# EAGLE schematic OpenDeck (EAGLE 6.5.0)
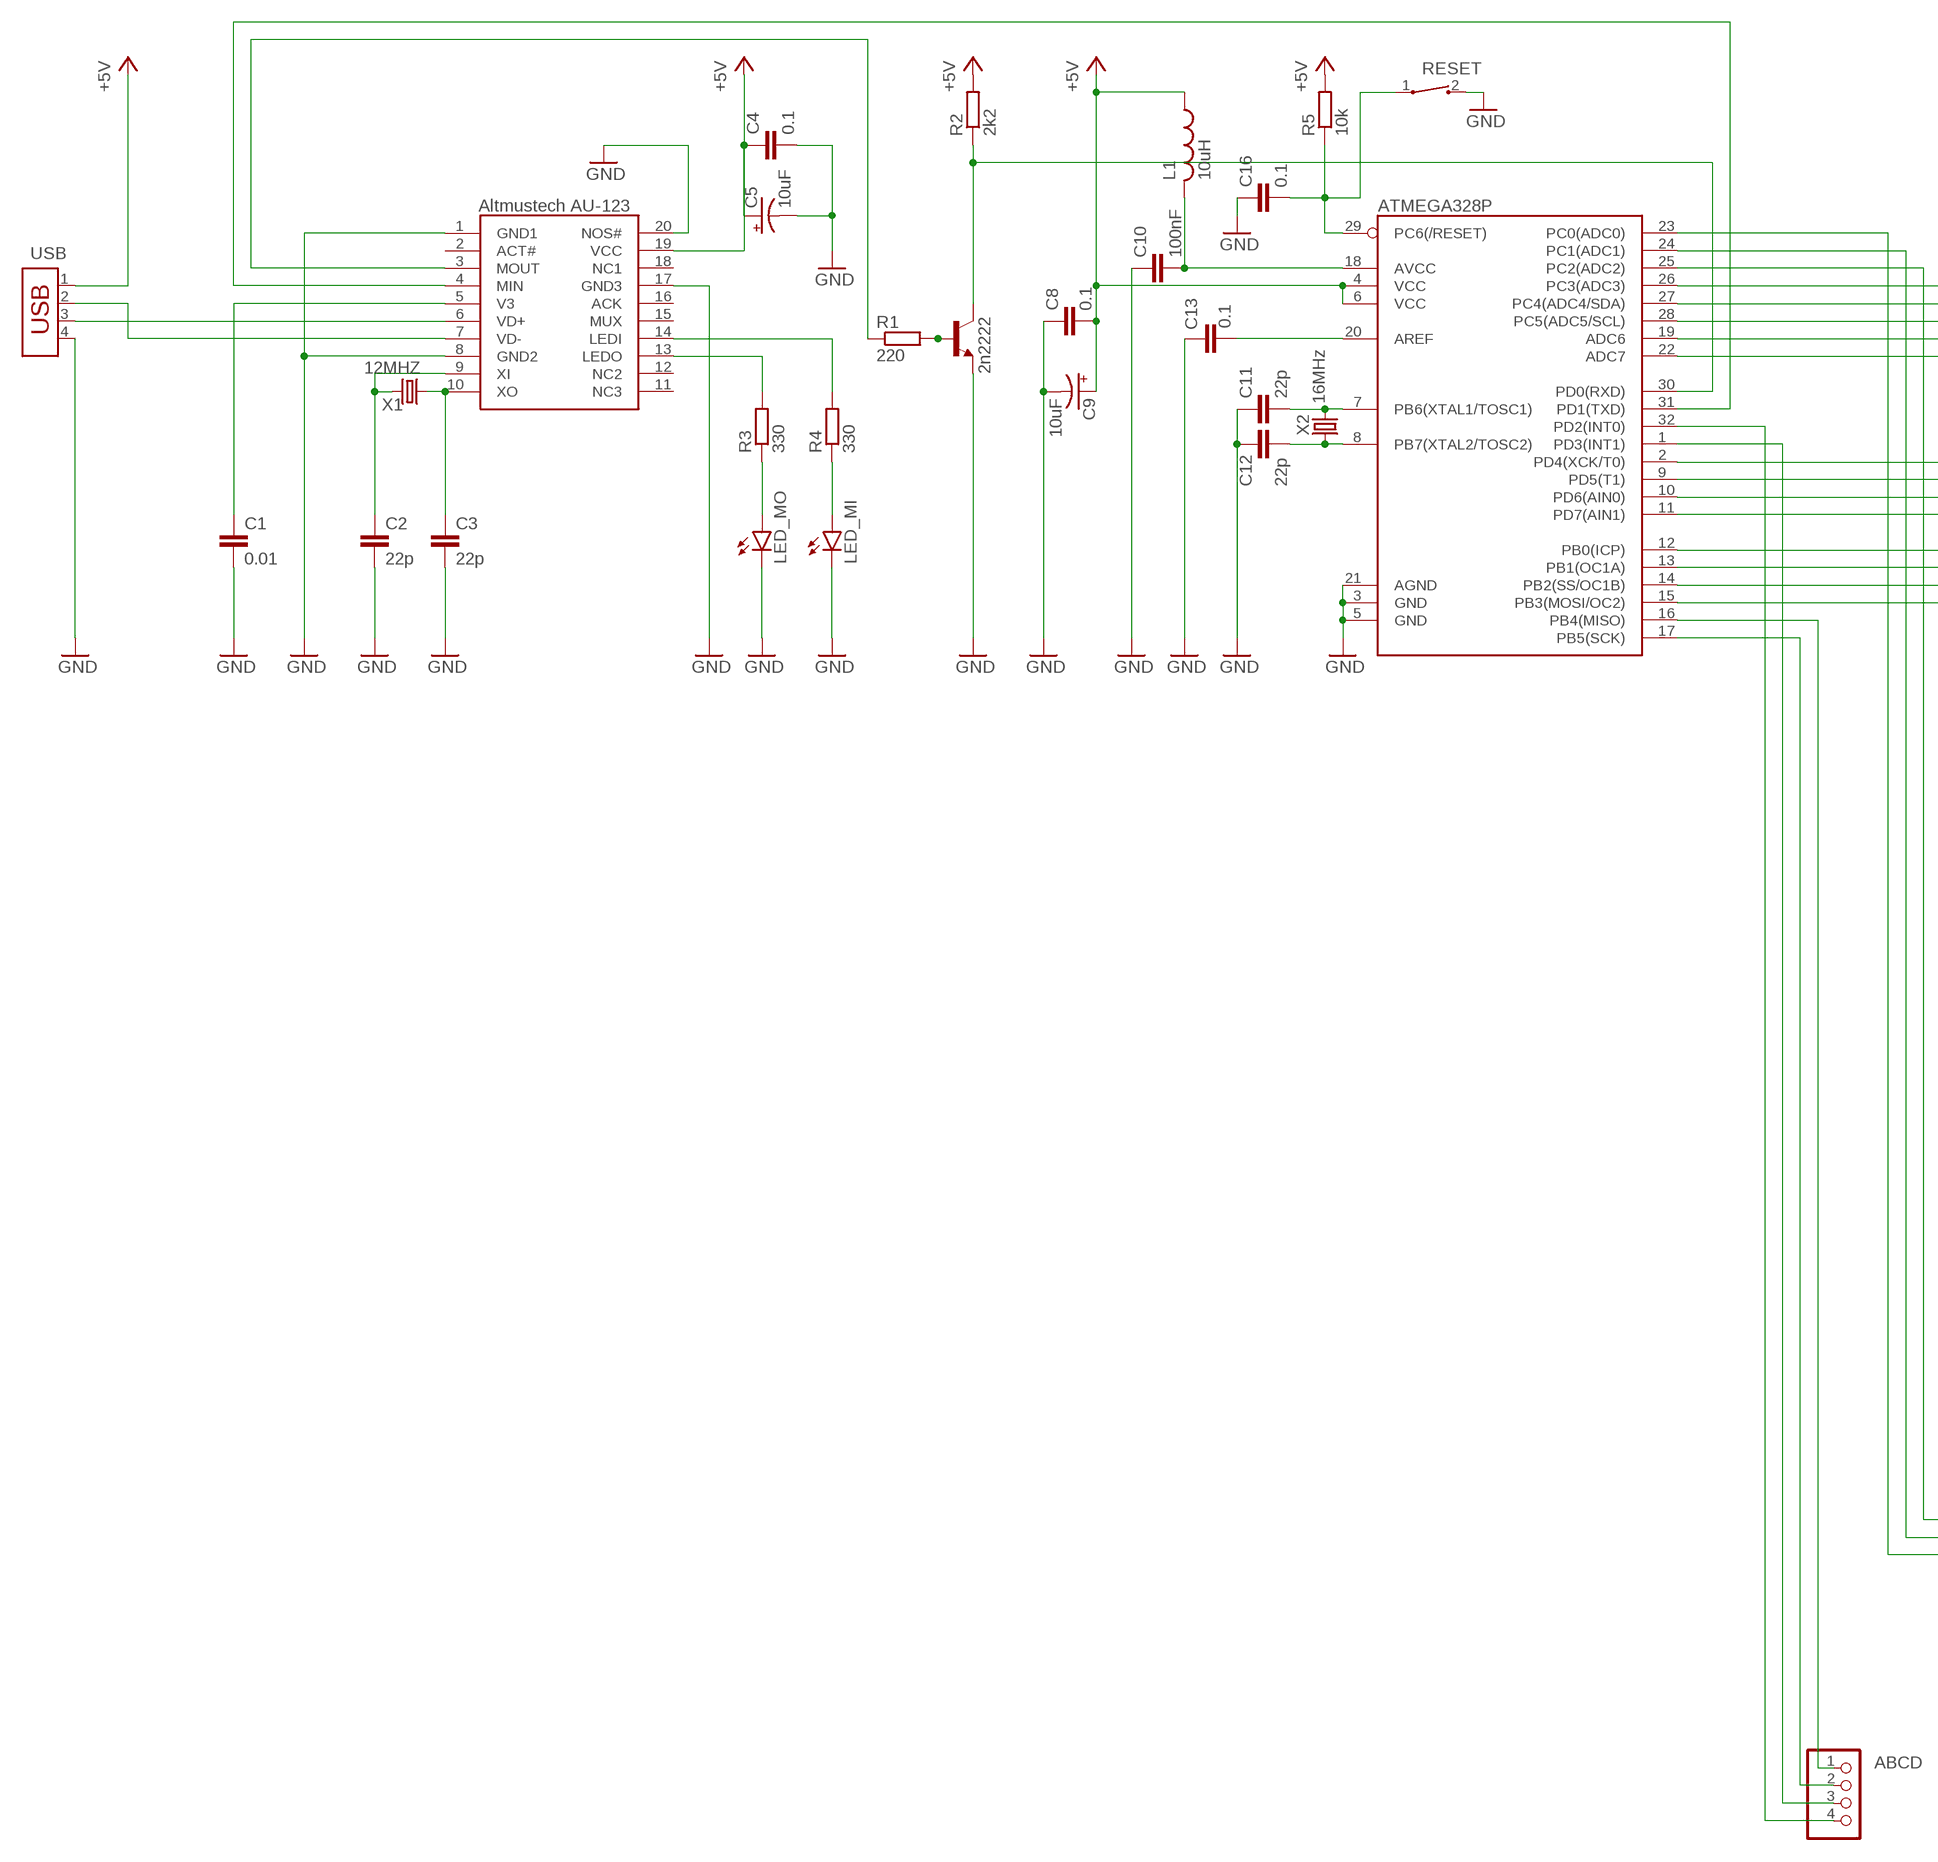
[diagram p0: schematic, sheet 1, part 1 of 2]
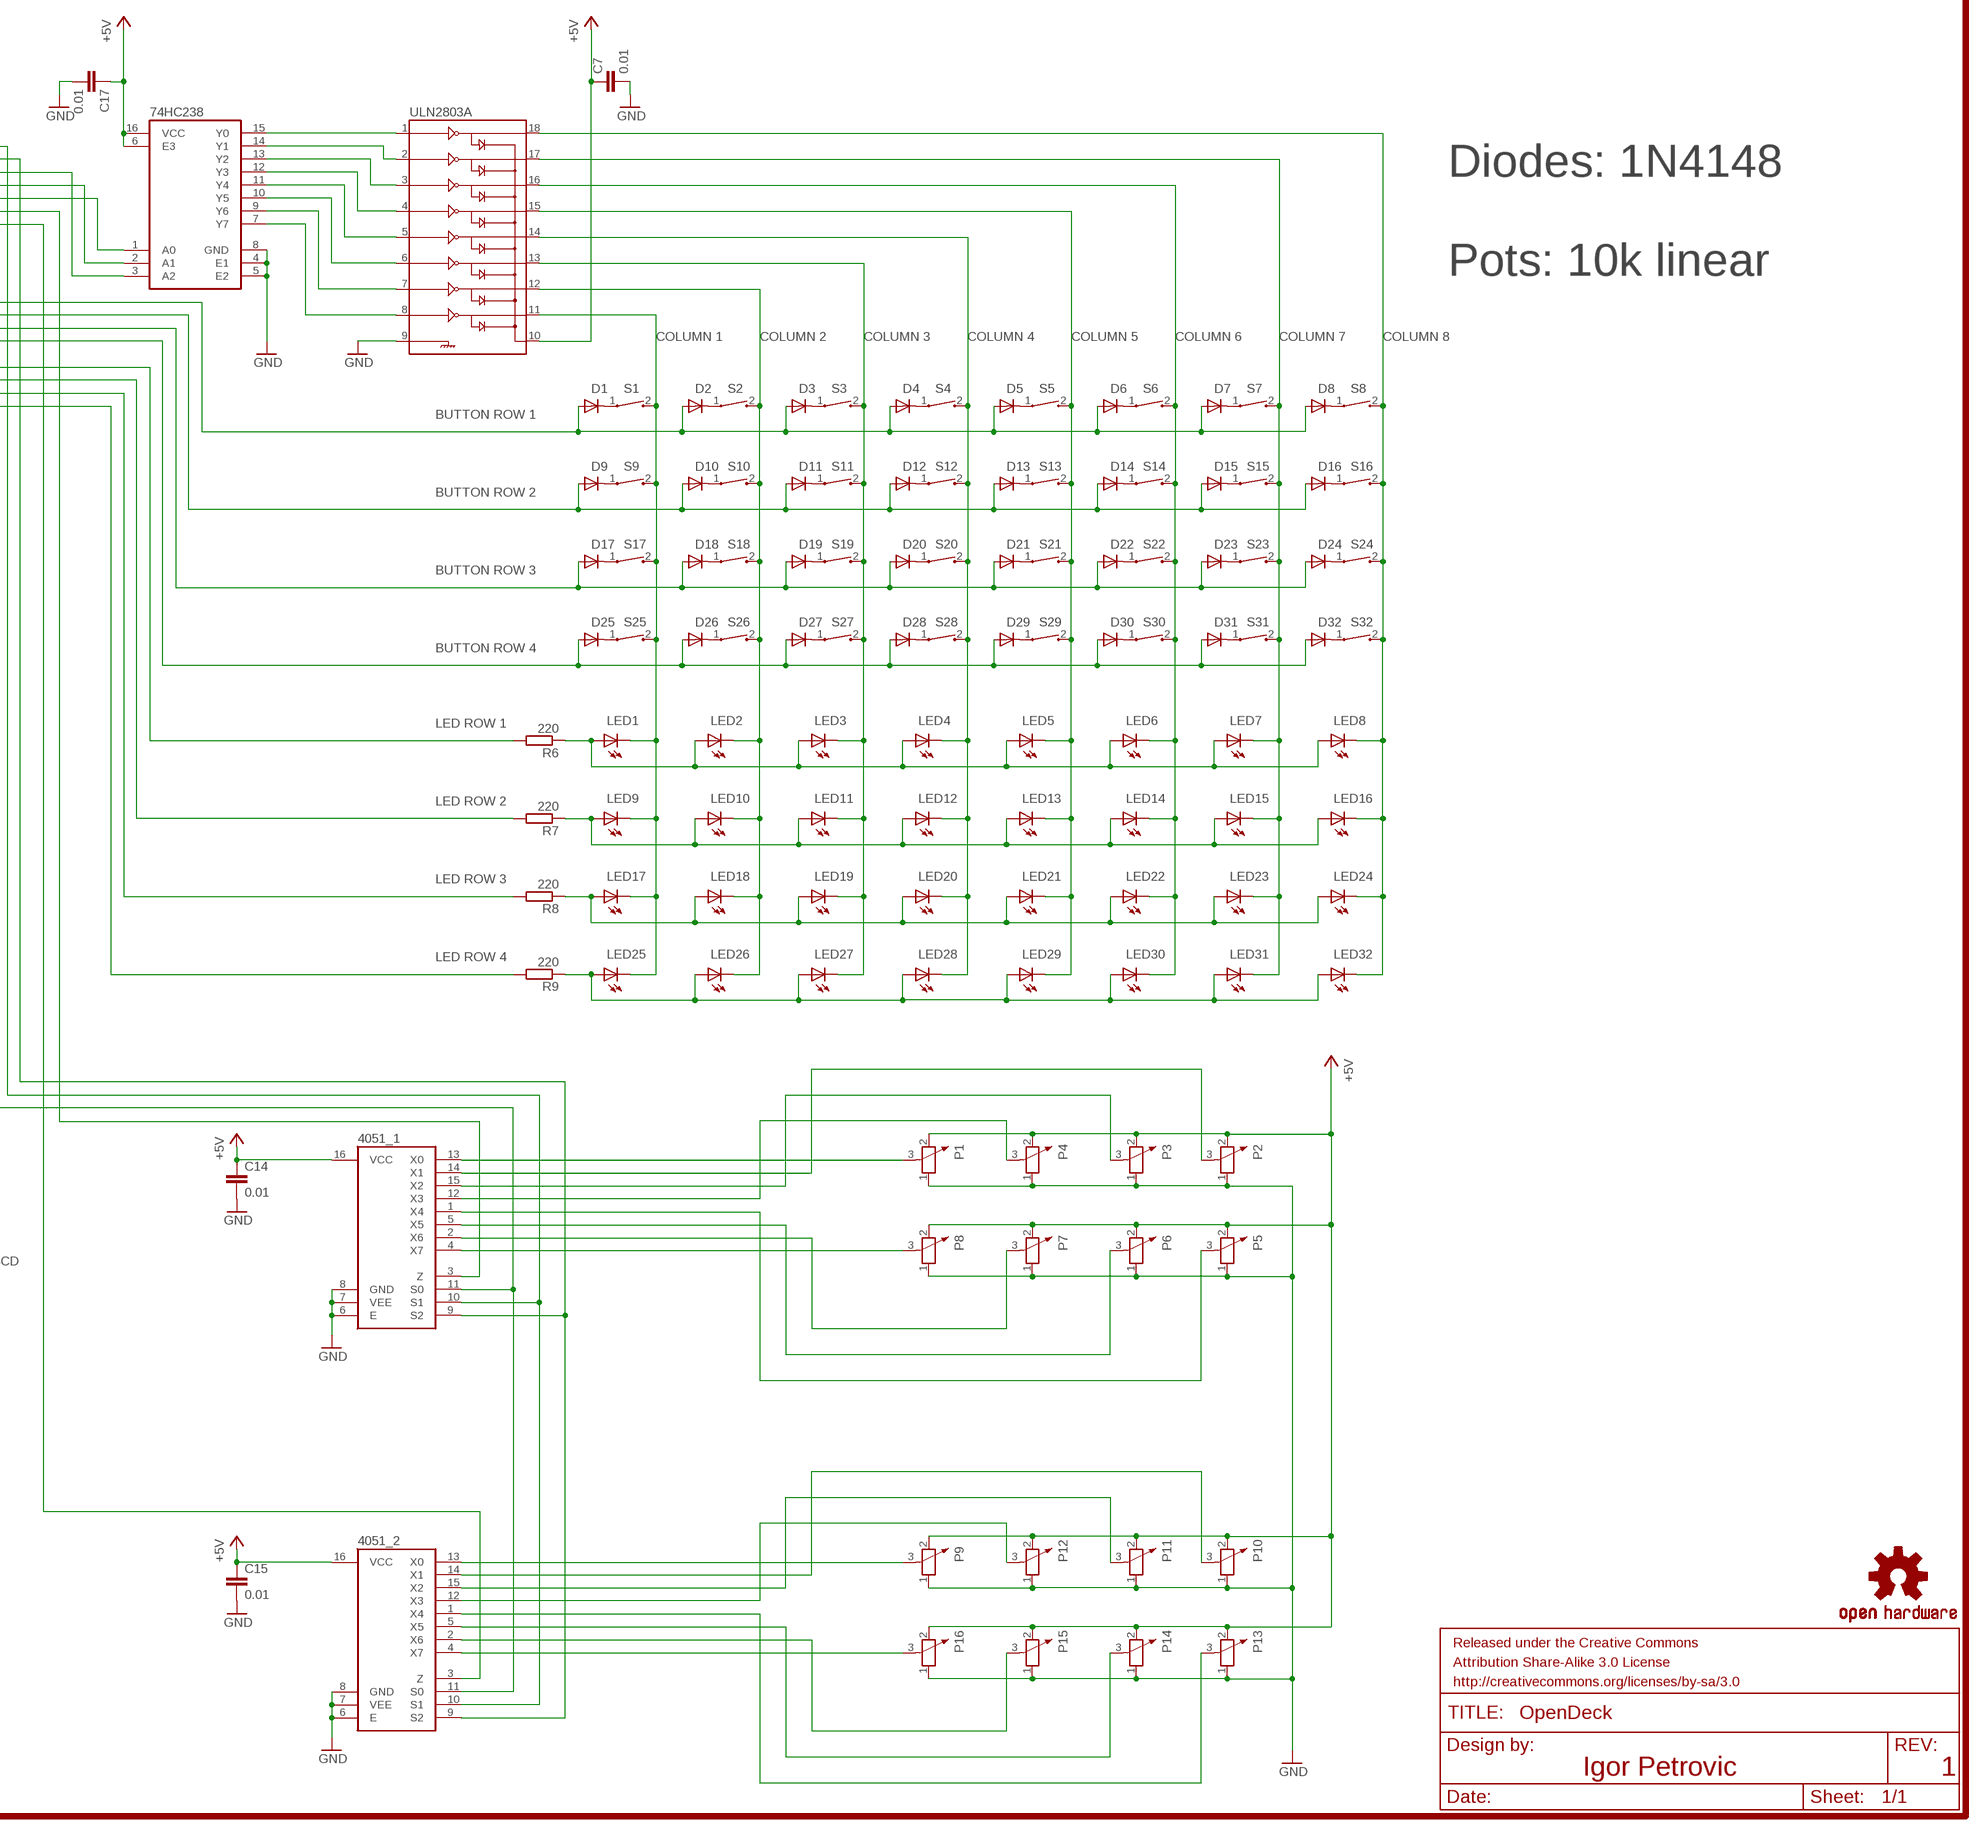
[diagram p1: schematic, sheet 1, part 2 of 2]

## Parts
74HC238  74HC238-FULL  [DIL16]
4051_1  4051-FULL  [DIL16]
4051_2  4051-FULL  [DIL16]
ABCD  PINHD-1X4  [1X04]
ALTMUSTECH_AU123  XC18V01_SO20  [SOP20]
C1  0.01  C-EU025-025X050  [C025-025X050]
C2  22p  C-EU025-025X050  [C025-025X050]
C3  22p  C-EU025-025X050  [C025-025X050]
C4  0.1  C-EU025-025X050  [C025-025X050]
C5  10uF  100UF-63V-20%(ELECT)  [PANASONIC_H13]
C7  0.01  C-EU025-025X050  [C025-025X050]
C8  0.1  C-EU025-025X050  [C025-025X050]
C9  10uF  100UF-63V-20%(ELECT)  [PANASONIC_H13]
C10  100nF  C-EU025-025X050  [C025-025X050]
C11  22p  C-EU025-025X050  [C025-025X050]
C12  22p  C-EU025-025X050  [C025-025X050]
C13  0.1  C-EU025-025X050  [C025-025X050]
C14  0.01  C-EU025-025X050  [C025-025X050]
C15  0.01  C-EU025-025X050  [C025-025X050]
C16  0.1  C-EU025-025X050  [C025-025X050]
C17  0.01  C-EU025-025X050  [C025-025X050]
D1  1N4148DO35-10  [DO35-10]
D2  1N4148DO35-10  [DO35-10]
D3  1N4148DO35-10  [DO35-10]
D4  1N4148DO35-10  [DO35-10]
D5  1N4148DO35-10  [DO35-10]
D6  1N4148DO35-10  [DO35-10]
D7  1N4148DO35-10  [DO35-10]
D8  1N4148DO35-10  [DO35-10]
D9  1N4148DO35-10  [DO35-10]
D10  1N4148DO35-10  [DO35-10]
D11  1N4148DO35-10  [DO35-10]
D12  1N4148DO35-10  [DO35-10]
D13  1N4148DO35-10  [DO35-10]
D14  1N4148DO35-10  [DO35-10]
D15  1N4148DO35-10  [DO35-10]
D16  1N4148DO35-10  [DO35-10]
D17  1N4148DO35-10  [DO35-10]
D18  1N4148DO35-10  [DO35-10]
D19  1N4148DO35-10  [DO35-10]
D20  1N4148DO35-10  [DO35-10]
D21  1N4148DO35-10  [DO35-10]
D22  1N4148DO35-10  [DO35-10]
D23  1N4148DO35-10  [DO35-10]
D24  1N4148DO35-10  [DO35-10]
D25  1N4148DO35-10  [DO35-10]
D26  1N4148DO35-10  [DO35-10]
D27  1N4148DO35-10  [DO35-10]
D28  1N4148DO35-10  [DO35-10]
D29  1N4148DO35-10  [DO35-10]
D30  1N4148DO35-10  [DO35-10]
D31  1N4148DO35-10  [DO35-10]
D32  1N4148DO35-10  [DO35-10]
FRAME1  FRAME-LETTER  [CREATIVE_COMMONS]
L1  10uH  L-US0204/7  [0204/7]
LED1  LAW51M  [W51]
LED2  LAW51M  [W51]
LED3  LAW51M  [W51]
LED4  LAW51M  [W51]
LED5  LAW51M  [W51]
LED6  LAW51M  [W51]
LED7  LAW51M  [W51]
LED8  LAW51M  [W51]
LED9  LAW51M  [W51]
LED10  LAW51M  [W51]
LED11  LAW51M  [W51]
LED12  LAW51M  [W51]
LED13  LAW51M  [W51]
LED14  LAW51M  [W51]
LED15  LAW51M  [W51]
LED16  LAW51M  [W51]
LED17  LAW51M  [W51]
LED18  LAW51M  [W51]
LED19  LAW51M  [W51]
LED20  LAW51M  [W51]
LED21  LAW51M  [W51]
LED22  LAW51M  [W51]
LED23  LAW51M  [W51]
LED24  LAW51M  [W51]
LED25  LAW51M  [W51]
LED26  LAW51M  [W51]
LED27  LAW51M  [W51]
LED28  LAW51M  [W51]
LED29  LAW51M  [W51]
LED30  LAW51M  [W51]
LED31  LAW51M  [W51]
LED32  LAW51M  [W51]
LED_MI  LED3MM  [LED3MM]
LED_MO  LED3MM  [LED3MM]
P1  10k  POTENTIOMETER_PT-10  [PT-10]
P2  10k  POTENTIOMETER_PT-10  [PT-10]
P3  10k  POTENTIOMETER_PT-10  [PT-10]
P4  10k  POTENTIOMETER_PT-10  [PT-10]
P5  10k  POTENTIOMETER_PT-10  [PT-10]
P6  10k  POTENTIOMETER_PT-10  [PT-10]
P7  10k  POTENTIOMETER_PT-10  [PT-10]
P8  10k  POTENTIOMETER_PT-10  [PT-10]
P9  10k  POTENTIOMETER_PT-10  [PT-10]
P10  10k  POTENTIOMETER_PT-10  [PT-10]
P11  10k  POTENTIOMETER_PT-10  [PT-10]
P12  10k  POTENTIOMETER_PT-10  [PT-10]
P13  10k  POTENTIOMETER_PT-10  [PT-10]
P14  10k  POTENTIOMETER_PT-10  [PT-10]
P15  10k  POTENTIOMETER_PT-10  [PT-10]
P16  10k  POTENTIOMETER_PT-10  [PT-10]
Q1  2n2222  TRANSISTOR_NPN2N3904  [TO-92]
R1  220  R-EU_0204/7  [0204/7]
R2  2k2  R-EU_0204/7  [0204/7]
R3  330  R-EU_0204/7  [0204/7]
R4  330  R-EU_0204/7  [0204/7]
R5  10k  R-EU_0204/7  [0204/7]
R6  220  R-EU_0204/7  [0204/7]
R7  220  R-EU_0204/7  [0204/7]
R8  220  R-EU_0204/7  [0204/7]
R9  220  R-EU_0204/7  [0204/7]
RESET  CT10-XXXX-A2  [CT10-XXXX-A2]
S1  CT10-XXXX-A2  [CT10-XXXX-A2]
S2  CT10-XXXX-A2  [CT10-XXXX-A2]
S3  CT10-XXXX-A2  [CT10-XXXX-A2]
S4  CT10-XXXX-A2  [CT10-XXXX-A2]
S5  CT10-XXXX-A2  [CT10-XXXX-A2]
S6  CT10-XXXX-A2  [CT10-XXXX-A2]
S7  CT10-XXXX-A2  [CT10-XXXX-A2]
S8  CT10-XXXX-A2  [CT10-XXXX-A2]
S9  CT10-XXXX-A2  [CT10-XXXX-A2]
S10  CT10-XXXX-A2  [CT10-XXXX-A2]
S11  CT10-XXXX-A2  [CT10-XXXX-A2]
S12  CT10-XXXX-A2  [CT10-XXXX-A2]
S13  CT10-XXXX-A2  [CT10-XXXX-A2]
S14  CT10-XXXX-A2  [CT10-XXXX-A2]
S15  CT10-XXXX-A2  [CT10-XXXX-A2]
S16  CT10-XXXX-A2  [CT10-XXXX-A2]
S17  CT10-XXXX-A2  [CT10-XXXX-A2]
S18  CT10-XXXX-A2  [CT10-XXXX-A2]
S19  CT10-XXXX-A2  [CT10-XXXX-A2]
S20  CT10-XXXX-A2  [CT10-XXXX-A2]
S21  CT10-XXXX-A2  [CT10-XXXX-A2]
S22  CT10-XXXX-A2  [CT10-XXXX-A2]
S23  CT10-XXXX-A2  [CT10-XXXX-A2]
S24  CT10-XXXX-A2  [CT10-XXXX-A2]
S25  CT10-XXXX-A2  [CT10-XXXX-A2]
S26  CT10-XXXX-A2  [CT10-XXXX-A2]
S27  CT10-XXXX-A2  [CT10-XXXX-A2]
S28  CT10-XXXX-A2  [CT10-XXXX-A2]
S29  CT10-XXXX-A2  [CT10-XXXX-A2]
S30  CT10-XXXX-A2  [CT10-XXXX-A2]
S31  CT10-XXXX-A2  [CT10-XXXX-A2]
S32  CT10-XXXX-A2  [CT10-XXXX-A2]
U2  ATMEGA328P  ATMEGA328_SMT  [TQFP32-08]
U$3  OSHW-LOGOS  [OSHW-LOGO-S]
ULN2803A  ULN2803DIP  [DIL18]
USB  USB-787616  [USB]
X1  12MHZ  CRYSTALHC49US  [HC49US]
X2  16MHz  CRYSTALHC49US  [HC49US]

## Nets
A: ABCD.1 U2.16(PB4(MISO))
A0: 74HC238.3(A2) U2.26(PC3(ADC3))
A1: 74HC238.2(A1) U2.27(PC4(ADC4/SDA))
A2: 74HC238.1(A0) U2.28(PC5(ADC5/SCL))
B: ABCD.2 U2.17(PB5(SCK))
B_ROW_1: D1.A D2.A D3.A D4.A D5.A D6.A D7.A D8.A U2.2(PD4(XCK/T0))
B_ROW_2: D9.A D10.A D11.A D12.A D13.A D14.A D15.A D16.A U2.9(PD5(T1))
B_ROW_3: D17.A D18.A D19.A D20.A D21.A D22.A D23.A D24.A U2.10(PD6(AIN0))
B_ROW_4: D25.A D26.A D27.A D28.A D29.A D30.A D31.A D32.A U2.11(PD7(AIN1))
C: ABCD.3 U2.1(PD3(INT1))
COLUMN_1: LED1.C LED9.C LED17.C LED25.C S1.2 S9.2 S17.2 S25.2 ULN2803A.11
COLUMN_2: LED2.C LED10.C LED18.C LED26.C S2.2 S10.2 S18.2 S26.2 ULN2803A.12
COLUMN_3: LED3.C LED11.C LED19.C LED27.C S3.2 S11.2 S19.2 S27.2 ULN2803A.13
COLUMN_4: LED4.C LED12.C LED20.C LED28.C S4.2 S12.2 S20.2 S28.2 ULN2803A.14
COLUMN_5: LED5.C LED13.C LED21.C LED29.C S5.2 S13.2 S21.2 S29.2 ULN2803A.15
COLUMN_6: LED6.C LED14.C LED22.C LED30.C S6.2 S14.2 S22.2 S30.2 ULN2803A.16
COLUMN_7: LED7.C LED15.C LED23.C LED31.C S7.2 S15.2 S23.2 S31.2 ULN2803A.17
COLUMN_8: LED8.C LED16.C LED24.C LED32.C S8.2 S16.2 S24.2 S32.2 ULN2803A.18
D: ABCD.4 U2.32(PD2(INT0))
DECODER_OUT_1: 74HC238.15(Y0) ULN2803A.1
DECODER_OUT_2: 74HC238.14(Y1) ULN2803A.2
DECODER_OUT_3: 74HC238.13(Y2) ULN2803A.3
DECODER_OUT_4: 74HC238.12(Y3) ULN2803A.4
DECODER_OUT_5: 74HC238.11(Y4) ULN2803A.5
DECODER_OUT_6: 74HC238.10(Y5) ULN2803A.6
DECODER_OUT_7: 74HC238.9(Y6) ULN2803A.7
DECODER_OUT_8: 74HC238.7(Y7) ULN2803A.8
GND: 74HC238.4(E1) 74HC238.5(E2) 74HC238.8(GND) 4051_1.6(E) 4051_1.7(VEE) 4051_1.8(GND) 4051_2.6(E) 4051_2.7(VEE) 4051_2.8(GND) ALTMUSTECH_AU123.1(GND1) ALTMUSTECH_AU123.8(GND2) ALTMUSTECH_AU123.17(GND3) ALTMUSTECH_AU123.20(NOS#) C1.2 C2.2 C3.2 C4.2 C5.- C7.2 C8.1 C9.- C10.1 C11.1 C12.2 C13.2 C14.2 C15.2 C16.1 C17.2 LED_MI.K(C) LED_MO.K(C) P1.1 P2.1 P3.1 P4.1 P5.1 P6.1 P7.1 P8.1 P9.1 P10.1 P11.1 P12.1 P13.1 P14.1 P15.1 P16.1 Q1.1(E) RESET.2 U2.3(GND) U2.5(GND) U2.21(AGND) ULN2803A.9 USB.4
L_ROW_1: LED1.A LED2.A LED3.A LED4.A LED5.A LED6.A LED7.A LED8.A R6.1
L_ROW_2: LED9.A LED10.A LED11.A LED12.A LED13.A LED14.A LED15.A LED16.A R7.1
L_ROW_4: LED25.A LED26.A LED27.A LED28.A LED29.A LED30.A LED31.A LED32.A R9.1
LEDI: ALTMUSTECH_AU123.14(LEDI) R4.2
LEDO: ALTMUSTECH_AU123.13(LEDO) R3.2
MIN: ALTMUSTECH_AU123.4(MIN) U2.31(PD1(TXD))
MOUT: ALTMUSTECH_AU123.3(MOUT) R1.1
MUX_1_IN: 4051_1.3(Z) U2.19(ADC6)
MUX_1_INPUT_1: 4051_1.13(X0) P1.3
MUX_1_INPUT_2: 4051_1.14(X1) P2.3
MUX_1_INPUT_3: 4051_1.15(X2) P3.3
MUX_1_INPUT_4: 4051_1.12(X3) P4.3
MUX_1_INPUT_5: 4051_1.1(X4) P5.3
MUX_1_INPUT_6: 4051_1.5(X5) P6.3
MUX_1_INPUT_7: 4051_1.2(X6) P7.3
MUX_1_INPUT_8: 4051_1.4(X7) P8.3
MUX_2_INPUT_1: 4051_2.13(X0) P9.3
MUX_2_INPUT_2: 4051_2.14(X1) P10.3
MUX_2_INPUT_3: 4051_2.15(X2) P11.3
MUX_2_INPUT_4: 4051_2.12(X3) P12.3
MUX_2_INPUT_5: 4051_2.1(X4) P13.3
MUX_2_INPUT_6: 4051_2.5(X5) P14.3
MUX_2_INPUT_7: 4051_2.2(X6) P15.3
MUX_2_INPUT_8: 4051_2.4(X7) P16.3
MUX_IN_2: 4051_2.3(Z) U2.22(ADC7)
N$2: D15.C S15.1
N$5: R7.2 U2.13(PB1(OC1A))
N$6: R8.2 U2.14(PB2(SS/OC1B))
N$7: R6.2 U2.12(PB0(ICP))
N$8: R9.2 U2.15(PB3(MOSI/OC2))
N$11: D9.C S9.1
N$12: D10.C S10.1
N$13: D11.C S11.1
N$14: D12.C S12.1
N$16: D14.C S14.1
N$18: D16.C S16.1
N$19: Q1.2(B) R1.2
N$22: Q1.3(C) R2.1 U2.30(PD0(RXD))
N$24: D6.C S6.1
N$25: D13.C S13.1
N$27: D5.C S5.1
N$28: LED17.A LED18.A LED19.A LED20.A LED21.A LED22.A LED23.A LED24.A R8.1
N$29: D17.C S17.1
N$30: D18.C S18.1
N$32: D19.C S19.1
N$34: D20.C S20.1
N$35: D21.C S21.1
N$36: D22.C S22.1
N$37: D23.C S23.1
N$38: D1.C S1.1
N$39: D24.C S24.1
N$42: LED_MO.A R3.1
N$43: LED_MI.A R4.1
N$47: C10.2 L1.2 U2.18(AVCC)
N$48: C11.2 U2.7(PB6(XTAL1/TOSC1)) X2.1
N$49: C12.1 U2.8(PB7(XTAL2/TOSC2)) X2.2
N$50: C13.1 U2.20(AREF)
N$52: D25.C S25.1
N$53: D26.C S26.1
N$54: D27.C S27.1
N$55: D28.C S28.1
N$56: D29.C S29.1
N$58: D30.C S30.1
N$59: D31.C S31.1
N$60: D32.C S32.1
N$61: C16.2 R5.1 RESET.1 U2.29(PC6(/RESET))
N$64: D2.C S2.1
N$66: D3.C S3.1
N$67: D4.C S4.1
N$71: D7.C S7.1
N$72: D8.C S8.1
S0: 4051_1.11(S0) 4051_2.11(S0) U2.23(PC0(ADC0))
S1: 4051_1.10(S1) 4051_2.10(S1) U2.24(PC1(ADC1))
S2: 4051_1.9(S2) 4051_2.9(S2) U2.25(PC2(ADC2))
V3: ALTMUSTECH_AU123.5(V3) C1.1
VCC: 74HC238.6(E3) 74HC238.16(VCC) 4051_1.16(VCC) 4051_2.16(VCC) ALTMUSTECH_AU123.19(VCC) C4.1 C5.+ C7.1 C8.2 C9.+ C14.1 C15.1 C17.1 L1.1 P1.2 P2.2 P3.2 P4.2 P5.2 P6.2 P7.2 P8.2 P9.2 P10.2 P11.2 P12.2 P13.2 P14.2 P15.2 P16.2 R2.2 R5.2 U2.4(VCC) U2.6(VCC) ULN2803A.10 USB.1 ; supply symbol labelled +5V
VD+: ALTMUSTECH_AU123.6(VD+) USB.3
VD-: ALTMUSTECH_AU123.7(VD-) USB.2
XI: ALTMUSTECH_AU123.9(XI) C2.1 X1.2
XO: ALTMUSTECH_AU123.10(XO) C3.1 X1.1
Unconnected: ALTMUSTECH_AU123.2(ACT#) ALTMUSTECH_AU123.11(NC3) ALTMUSTECH_AU123.12(NC2) ALTMUSTECH_AU123.15(MUX) ALTMUSTECH_AU123.16(ACK) ALTMUSTECH_AU123.18(NC1) LED1.TH@1(TH) LED1.TH@2(TH) LED1.TH@3(TH) LED2.TH@1(TH) LED2.TH@2(TH) LED2.TH@3(TH) LED3.TH@1(TH) LED3.TH@2(TH) LED3.TH@3(TH) LED4.TH@1(TH) LED4.TH@2(TH) LED4.TH@3(TH) LED5.TH@1(TH) LED5.TH@2(TH) LED5.TH@3(TH) LED6.TH@1(TH) LED6.TH@2(TH) LED6.TH@3(TH) LED7.TH@1(TH) LED7.TH@2(TH) LED7.TH@3(TH) LED8.TH@1(TH) LED8.TH@2(TH) LED8.TH@3(TH) LED9.TH@1(TH) LED9.TH@2(TH) LED9.TH@3(TH) LED10.TH@1(TH) LED10.TH@2(TH) LED10.TH@3(TH) LED11.TH@1(TH) LED11.TH@2(TH) LED11.TH@3(TH) LED12.TH@1(TH) LED12.TH@2(TH) LED12.TH@3(TH) LED13.TH@1(TH) LED13.TH@2(TH) LED13.TH@3(TH) LED14.TH@1(TH) LED14.TH@2(TH) LED14.TH@3(TH) LED15.TH@1(TH) LED15.TH@2(TH) LED15.TH@3(TH) LED16.TH@1(TH) LED16.TH@2(TH) LED16.TH@3(TH) LED17.TH@1(TH) LED17.TH@2(TH) LED17.TH@3(TH) LED18.TH@1(TH) LED18.TH@2(TH) LED18.TH@3(TH) LED19.TH@1(TH) LED19.TH@2(TH) LED19.TH@3(TH) LED20.TH@1(TH) LED20.TH@2(TH) LED20.TH@3(TH) LED21.TH@1(TH) LED21.TH@2(TH) LED21.TH@3(TH) LED22.TH@1(TH) LED22.TH@2(TH) LED22.TH@3(TH) LED23.TH@1(TH) LED23.TH@2(TH) LED23.TH@3(TH) LED24.TH@1(TH) LED24.TH@2(TH) LED24.TH@3(TH) LED25.TH@1(TH) LED25.TH@2(TH) LED25.TH@3(TH) LED26.TH@1(TH) LED26.TH@2(TH) LED26.TH@3(TH) LED27.TH@1(TH) LED27.TH@2(TH) LED27.TH@3(TH) LED28.TH@1(TH) LED28.TH@2(TH) LED28.TH@3(TH) LED29.TH@1(TH) LED29.TH@2(TH) LED29.TH@3(TH) LED30.TH@1(TH) LED30.TH@2(TH) LED30.TH@3(TH) LED31.TH@1(TH) LED31.TH@2(TH) LED31.TH@3(TH) LED32.TH@1(TH) LED32.TH@2(TH) LED32.TH@3(TH)

## Notes on the sheet
- Altmustech AU-123 | 74HC238
- Diodes: 1N4148
  
  Pots: 10k linear
- COLUMN 1 | COLUMN 2 | COLUMN 3 | COLUMN 4 | COLUMN 5 | COLUMN 6 | COLUMN 7 | COLUMN 8
- BUTTON ROW 1
- BUTTON ROW 2
- BUTTON ROW 3
- BUTTON ROW 4
- LED ROW 1
- LED ROW 2
- LED ROW 3
- LED ROW 4
- Igor Petrovic | 1

## Library data of the parts
74HC238 = 74ac-logic:74HC238-FULL
4051_1 4051_2 = 40xx:4051-FULL: 4051 Multiplexer
ABCD = pinhead:PINHD-1X4: PIN HEADER
ALTMUSTECH_AU123 = xilinx-xc18v:XC18V01_SO20: Altmustech AU-123 edit this description Rev.1
C1-C4 C7 C8 C10-C17 = rcl:C-EU: CAPACITOR, European symbol
C5 C9 = SparkFun-Capacitors:100UF-63V-20%(ELECT): CAP-08362 100uF electrolytic SMT 63V 20%; PROD_ID: CAP-08362; VALUE: 100uF
D1-D32 = diode:1N4148: DIODE high speed (Philips)
FRAME1 = SparkFun-Aesthetics:FRAME-LETTER: Schematic Frame Standard 8.5x11 US Letter frame
L1 = rcl:L-US: INDUCTOR, American symbol
LED1-LED32 = led:*W51M: Golden DRAGON® with Lens Enhanced Thinfilm LED Source: LA_LR_LY_W51M_Pb_free[1].pdf
LED_MI LED_MO = SparkFun-LED:LED: LEDs Standard schematic elements and footprints for 5mm, 3mm, 1206, and 0603 sized LEDs. 5mm - Spark Fun Electronics SKU : COM-00529 (and others)
P1-P16 = rcl:POTENTIOMETER_: Potentiometer
Q1 = SparkFun-DiscreteSemi:TRANSISTOR_NPN: Generic NPN BJT MMBT2222A - TRANS-08049 (SOT-23, 1A 40V) MPSA42 - TRANS-09116 (SOT-23, 500mA 300V) MMBT5088LT1G - TRANS-11160 (SOT-23, 50 mA 30V) BC547 - COM-08928 <http://www.sparkfun.com/products/8928> (TO-92 45V 100mA) (1.Collector 2.Base 3.Emitter) 2N3904 - COM-00521 <http://www.sparkfun.com/products/521> (TO-92 40V 200mA) (1.Emitter 2.Base 3.Collector) P2N2222A - COM-12852 <http://www.sparkfun.com/products/12852> (TO-92 40V 600mA) (1.Collector 2.Base 3.Emitter); PROD_ID: TRANS-08447
R1-R9 = rcl:R-EU_: RESISTOR, European symbol
RESET S1-S32 = switch-coto:CT10-XXXX-: CT10 Series Molded Switch Source: www.cotorelay.com .. Coto_Technology__CT10-1530-G1.pdf
U2 = SparkFun-DigitalIC:ATMEGA328_SMT: 32-Pin Atmega328 part Commonly used on Arduino compatible boards Available in QFP and QFN packages TQFP is IC-09069 QFN is non-stock; PROD_ID: IC-09069
U$3 = SparkFun:OSHW-LOGO: Open Source Hardware Logo This logo indicates the piece of hardware it is found on incorporates a OSHW license and/or adheres to the definition of open source hardware found here: http://freedomdefined.org/OSHW
ULN2803A = SparkFun-PowerIC:ULN2803: Darlington Driver ULN2803 Darlington array. 500mA max per channel, 8-channel package. Spark Fun Electronics SKU : COM-00312
USB = con-amp:USB-787616: AMP connector
X1 X2 = SparkFun-FreqCtrl:CRYSTAL: Various standard crystals. Proven footprints. Spark Fun Electronics SKU : COM-00534

## Net classes
0 default: width 0.203 mm
1 vcc: width 0.254 mm